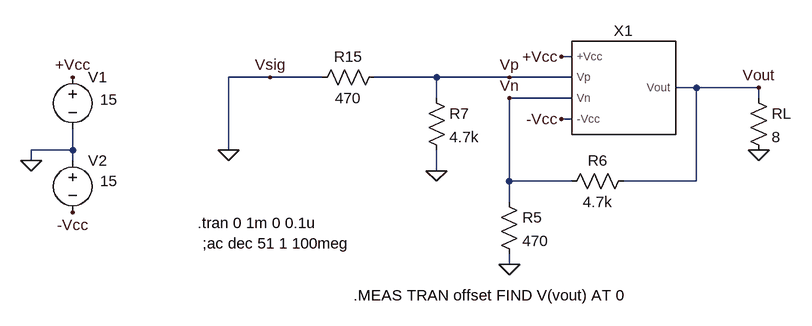
[diagram p0: schematic 8-offset-voltage.asc]
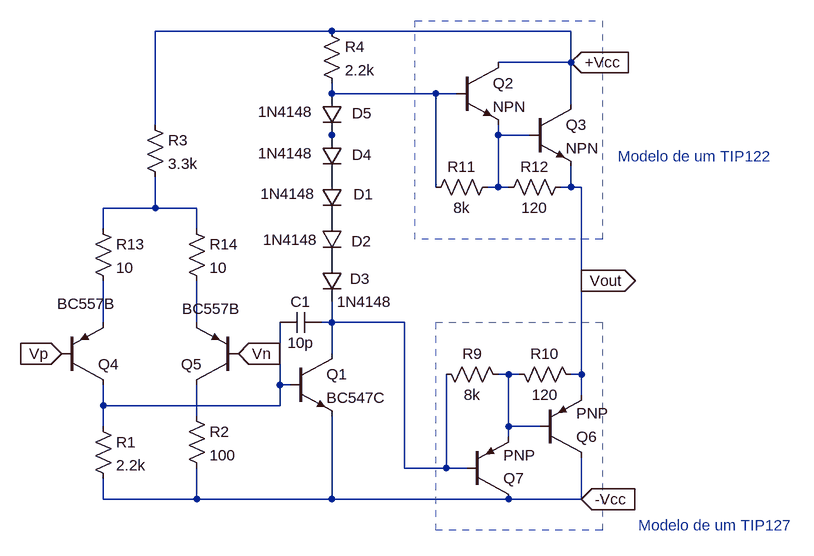
[diagram p1: sub-circuit audioamp.asc]
8-offset-voltage.asc, the LTspice schematic file:
Version 4
SHEET 1 1376 680
WIRE 288 128 272 128
WIRE -176 160 -240 160
WIRE -96 160 -176 160
WIRE 80 160 -16 160
WIRE 192 160 80 160
WIRE 288 160 192 160
WIRE 480 176 448 176
WIRE 576 176 480 176
WIRE 80 192 80 160
WIRE 288 192 192 192
WIRE 576 192 576 176
WIRE 288 224 272 224
WIRE -480 272 -480 240
WIRE -480 272 -544 272
WIRE -240 272 -240 160
WIRE -544 288 -544 272
WIRE -480 288 -480 272
WIRE 80 304 80 272
WIRE 192 320 192 192
WIRE 288 320 192 320
WIRE 480 320 480 176
WIRE 480 320 368 320
WIRE 192 352 192 320
WIRE 192 448 192 432
FLAG -240 272 0
FLAG -544 288 0
FLAG -480 160 +Vcc
FLAG -480 368 -Vcc
FLAG 576 272 0
FLAG 192 448 0
FLAG 576 176 Vout
FLAG 80 304 0
FLAG 272 128 +Vcc
FLAG 272 224 -Vcc
FLAG 192 160 Vp
FLAG 192 192 Vn
FLAG -176 160 Vsig
SYMBOL res 176 336 R0
SYMATTR InstName R5
SYMATTR Value 470
SYMBOL voltage -480 144 R0
WINDOW 123 42 82 Left 2
WINDOW 39 0 0 Left 2
WINDOW 3 42 50 Left 2
SYMATTR Value 15
SYMATTR InstName V1
SYMBOL voltage -480 272 R0
WINDOW 123 42 76 Left 2
WINDOW 39 0 0 Left 2
WINDOW 3 42 48 Left 2
SYMATTR Value 15
SYMATTR InstName V2
SYMBOL res 560 176 R0
SYMATTR InstName RL
SYMATTR Value 8
SYMBOL res 384 304 R90
WINDOW 0 0 56 VBottom 2
WINDOW 3 32 56 VTop 2
SYMATTR InstName R6
SYMATTR Value 4.7k
SYMBOL res 64 176 R0
SYMATTR InstName R7
SYMATTR Value 4.7k
SYMBOL res 0 144 R90
WINDOW 0 0 56 VBottom 2
WINDOW 3 32 56 VTop 2
SYMATTR InstName R15
SYMATTR Value 470
SYMBOL AudioAmp 368 176 R0
SYMATTR InstName X1
TEXT -288 384 Left 2 !.tran 0 1m 0 0.1u
TEXT -280 416 Left 2 !;ac dec 51 1 100meg
TEXT -48 496 Left 2 !.MEAS TRAN offset FIND V(vout) AT 0

audioamp.asc, the sub-circuit schematic file:
Version 4
SHEET 1 1376 680
WIRE 320 -336 48 -336
WIRE 688 -336 320 -336
WIRE 688 -288 688 -336
WIRE 688 -288 576 -288
WIRE 320 -240 320 -256
WIRE 480 -240 320 -240
WIRE 512 -240 480 -240
WIRE 688 -224 688 -288
WIRE 48 -192 48 -336
WIRE 320 -176 320 -192
WIRE 576 -176 576 -192
WIRE 624 -176 576 -176
WIRE 480 -96 480 -240
WIRE 576 -96 576 -176
WIRE 576 -96 560 -96
WIRE 592 -96 576 -96
WIRE 688 -96 688 -128
WIRE 688 -96 672 -96
WIRE 704 -96 688 -96
WIRE 48 -64 48 -112
WIRE 48 -64 -32 -64
WIRE 112 -64 48 -64
WIRE -32 -32 -32 -64
WIRE 112 -32 112 -64
WIRE 704 48 704 -96
WIRE -32 112 -32 48
WIRE 112 112 112 48
WIRE 320 112 320 80
WIRE 320 112 304 112
WIRE 432 112 320 112
WIRE 320 160 320 112
WIRE 592 192 576 192
WIRE 608 192 592 192
WIRE 704 192 704 48
WIRE 704 192 688 192
WIRE 240 208 240 112
WIRE 256 208 240 208
WIRE 704 224 704 192
WIRE -32 240 -32 208
WIRE 240 240 240 208
WIRE 240 240 -32 240
WIRE 112 256 112 208
WIRE -32 272 -32 240
WIRE 592 272 592 192
WIRE 640 272 592 272
WIRE 592 288 592 272
WIRE 432 336 432 112
WIRE 496 336 496 192
WIRE 496 336 432 336
WIRE 528 336 496 336
WIRE -32 384 -32 352
WIRE 112 384 112 336
WIRE 112 384 -32 384
WIRE 320 384 320 256
WIRE 320 384 112 384
WIRE 592 384 320 384
WIRE 704 384 704 320
WIRE 704 384 592 384
FLAG 688 -288 +Vcc
IOPIN 688 -288 In
FLAG 704 384 -Vcc
IOPIN 704 384 In
FLAG 704 48 Vout
IOPIN 704 48 Out
FLAG -96 160 Vp
IOPIN -96 160 In
FLAG 176 160 Vn
IOPIN 176 160 In
SYMBOL pnp -96 208 M180
WINDOW 3 -7 125 Left 2
SYMATTR Value BC557B
SYMATTR InstName Q4
SYMBOL pnp 176 208 R180
WINDOW 3 -3 117 Left 2
SYMATTR Value BC557B
SYMATTR InstName Q5
SYMBOL res -48 256 R0
SYMATTR InstName R1
SYMATTR Value 2.2k
SYMBOL res 32 -208 R0
SYMATTR InstName R3
SYMATTR Value 3.3k
SYMBOL res 304 -352 R0
SYMATTR InstName R4
SYMATTR Value 2.2k
SYMBOL res 96 240 R0
SYMATTR InstName R2
SYMATTR Value 100
SYMBOL res 480 176 M90
WINDOW 0 0 56 VBottom 2
WINDOW 3 32 56 VTop 2
SYMATTR InstName R9
SYMATTR Value 8k
SYMBOL res 592 176 M90
WINDOW 0 0 56 VBottom 2
WINDOW 3 32 56 VTop 2
SYMATTR InstName R10
SYMATTR Value 120
SYMBOL npn 512 -288 R0
SYMATTR InstName Q2
SYMBOL npn 624 -224 R0
SYMATTR InstName Q3
SYMBOL res 464 -80 R270
WINDOW 0 32 56 VTop 2
WINDOW 3 0 56 VBottom 2
SYMATTR InstName R11
SYMATTR Value 8k
SYMBOL res 576 -80 R270
WINDOW 0 32 56 VTop 2
WINDOW 3 0 56 VBottom 2
SYMATTR InstName R12
SYMATTR Value 120
SYMBOL pnp 640 320 M180
SYMATTR InstName Q6
SYMBOL pnp 528 384 M180
SYMATTR InstName Q7
SYMBOL npn 256 160 R0
SYMATTR InstName Q1
SYMATTR Value BC547C
SYMBOL cap 304 96 R90
WINDOW 0 0 32 VBottom 2
WINDOW 3 32 32 VTop 2
SYMATTR InstName C1
SYMATTR Value 10p
SYMBOL diode 304 -112 R0
WINDOW 0 49 27 Left 2
WINDOW 3 -94 26 Left 2
SYMATTR InstName D1
SYMATTR Value 1N4148
SYMBOL diode 304 -48 R0
WINDOW 0 46 35 Left 2
WINDOW 3 -90 33 Left 2
SYMATTR InstName D2
SYMATTR Value 1N4148
SYMBOL diode 304 16 R0
WINDOW 0 44 29 Left 2
SYMATTR InstName D3
SYMATTR Value 1N4148
SYMBOL diode 304 -176 R0
WINDOW 0 47 30 Left 2
WINDOW 3 -98 28 Left 2
SYMATTR InstName D4
SYMATTR Value 1N4148
SYMBOL diode 304 -240 R0
WINDOW 0 47 30 Left 2
WINDOW 3 -98 28 Left 2
SYMATTR InstName D5
SYMATTR Value 1N4148
SYMBOL res -48 -48 R0
SYMATTR InstName R13
SYMATTR Value 10
SYMBOL res 96 -48 R0
SYMATTR InstName R14
SYMATTR Value 10
TEXT 760 -144 Left 2 ;Modelo de um TIP122
TEXT 792 424 Left 2 ;Modelo de um TIP127
RECTANGLE Normal 736 -16 448 -352 2
RECTANGLE Normal 736 432 480 112 2

The netlist it stands for:
* 8-offset-voltage.asc
R5 Vn 0 470
V1 +Vcc 0 15
V2 0 -Vcc 15
RL Vout 0 8
R6 Vout Vn 4.7k
R7 Vp 0 4.7k
R15 Vp 0 470
XX1 +Vcc -Vcc Vn Vp Vout audioamp

* block symbol definitions
.subckt audioamp +Vcc -Vcc Vn Vp Vout
Q4 N009 Vp N005 0 BC557B
Q5 N010 Vn N006 0 BC557B
R1 N009 -Vcc 2.2k
R3 +Vcc N004 3.3k
R4 +Vcc N001 2.2k
R2 N010 -Vcc 100
R9 N007 N008 8k
R10 N008 Vout 120
Q2 +Vcc N001 N003 0 NPN
Q3 +Vcc N003 Vout 0 NPN
R11 N001 N003 8k
R12 N003 Vout 120
Q6 -Vcc N008 Vout 0 PNP
Q7 -Vcc N007 N008 0 PNP
Q1 N007 N009 -Vcc 0 BC547C
C1 N007 N009 10p
D1 P001 P002 1N4148
D2 P002 P003 1N4148
D3 P003 N007 1N4148
D4 N002 P001 1N4148
D5 N001 N002 1N4148
R13 N004 N005 10
R14 N004 N006 10
* Modelo de um TIP122
* Modelo de um TIP127
.ends audioamp

.model D D
.lib standard.dio
.model NPN NPN
.model PNP PNP
.lib standard.bjt
.tran 0 1m 0 0.1u
;ac dec 51 1 100meg
.MEAS TRAN offset FIND V(vout) AT 0
.backanno
.end